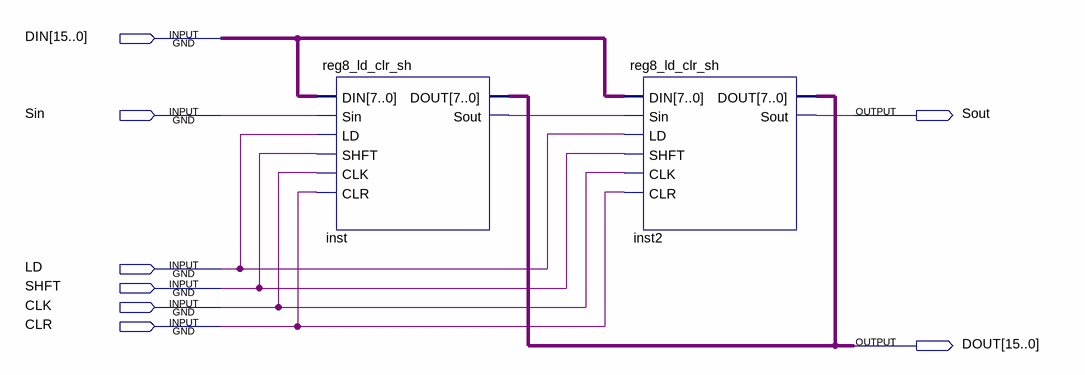
[diagram p0: schematic sheet]
// Quartus schematic reg16_ld_clr_sh.bdf as structural Verilog: 2 symbols, 8 pins
module reg16_ld_clr_sh (
  input  [15:0] DIN,
  input  Sin,
  input  LD,
  input  SHFT,
  input  CLK,
  input  CLR,
  output Sout,
  output [15:0] DOUT
);

  wire inst_sout;

  reg8_ld_clr_sh inst (
    .DIN(DIN[15:8]), .Sin(Sin), .LD(LD), .SHFT(SHFT), .CLK(CLK), .CLR(CLR), .Sout(inst_sout),
    .DOUT(DOUT[15:8]));
  reg8_ld_clr_sh inst2 (
    .DIN(DIN[7:0]), .Sin(inst_sout), .LD(LD), .SHFT(SHFT), .CLK(CLK), .CLR(CLR), .Sout(Sout), .DOUT(DOUT[7:0]));
endmodule
